# Altium schematic sheet RPI Arduino Shied Main.SchDoc
size A4
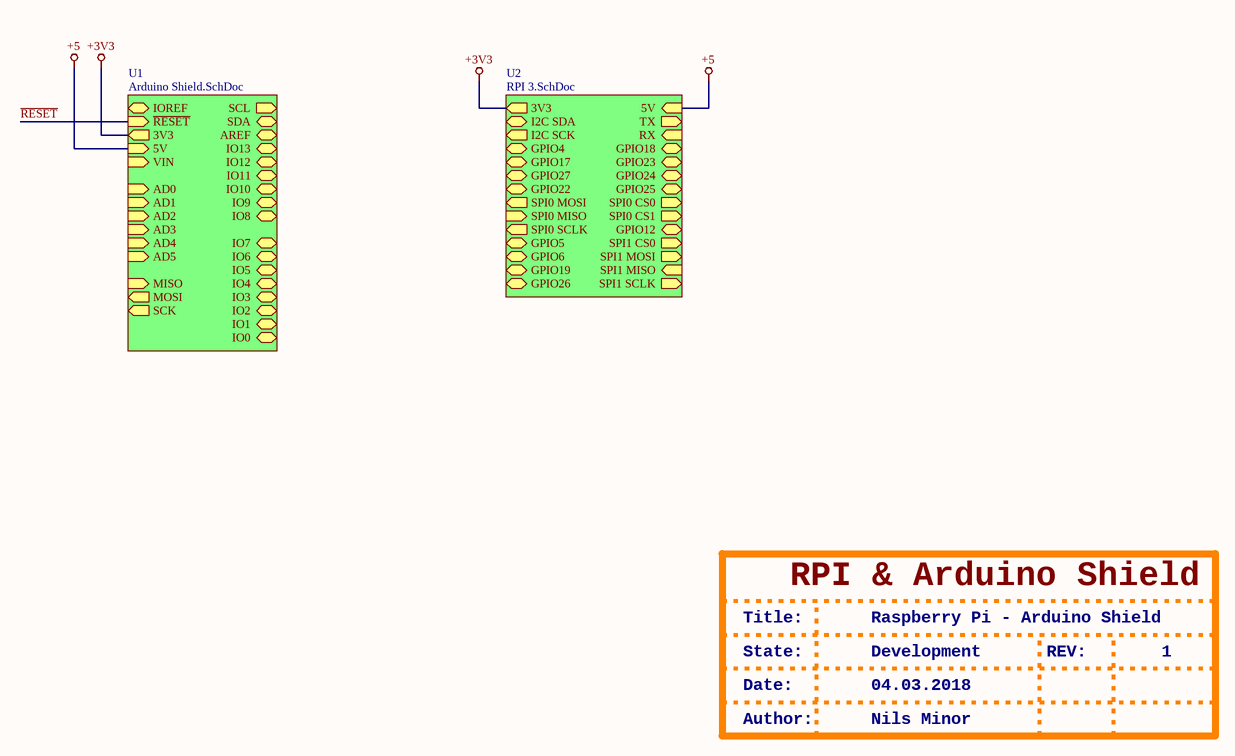
[diagram p0: RPI Arduino Shied Main.SchDoc]

## Sub-sheets
U1 = Arduino Shield.SchDoc: IOREF (bidir), ~{RESET} (in), 3V3 (out), 5V (in), VIN (in), AD0 (in), AD1 (in), AD2 (in), AD3 (in), AD4 (in), AD5 (in), IO0 (bidir), IO7 (bidir), IO6 (bidir), IO5 (bidir), IO4 (bidir), IO3 (bidir), IO2 (bidir), IO1 (bidir), IO8 (bidir), AREF (bidir), IO13 (bidir), IO12 (bidir), IO11 (bidir), IO10 (bidir), IO9 (bidir), SDA (bidir), SCL (out), MISO (in), SCK (out), MOSI (out)
U2 = RPI 3.SchDoc: I2C SDA (bidir), I2C SCK (out), GPIO4 (bidir), GPIO17 (bidir), GPIO27 (bidir), GPIO22 (bidir), SPI0 MOSI (out), SPI0 MISO (in), SPI0 SCLK (out), GPIO26 (bidir), GPIO19 (bidir), GPIO6 (bidir), GPIO5 (bidir), SPI1 MISO (in), SPI1 MOSI (out), SPI0 CS1 (out), SPI1 SCLK (out), SPI0 CS0 (out), RX (in), TX (out), GPIO23 (bidir), GPIO24 (bidir), GPIO25 (bidir), GPIO12 (bidir), SPI1 CS0 (out), 5V (in), 3V3 (out), GPIO18 (bidir)

## Nets
+3V3: sheet U1/3V3, sheet U2/3V3
+5: sheet U1/5V, sheet U2/5V
~{RESET}: sheet U1/~{RESET}

## Notes on the sheet
- RPI & Arduino Shield
- Title:
- State:
- Raspberry Pi - Arduino Shield
- Development
- REV:
- 1
- Date:
- Author:
- 04.03.2018
- Nils Minor